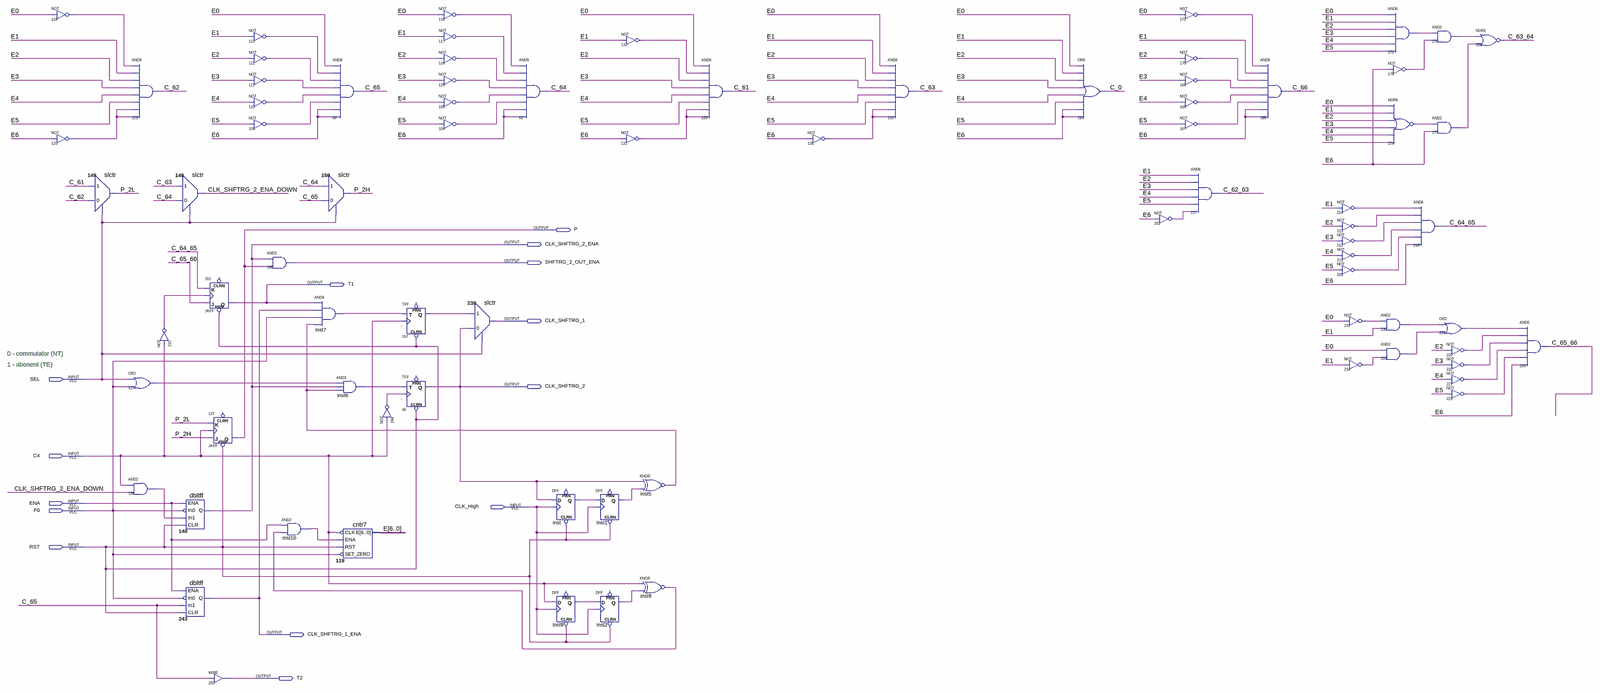
[diagram p0: schematic sheet, whole]
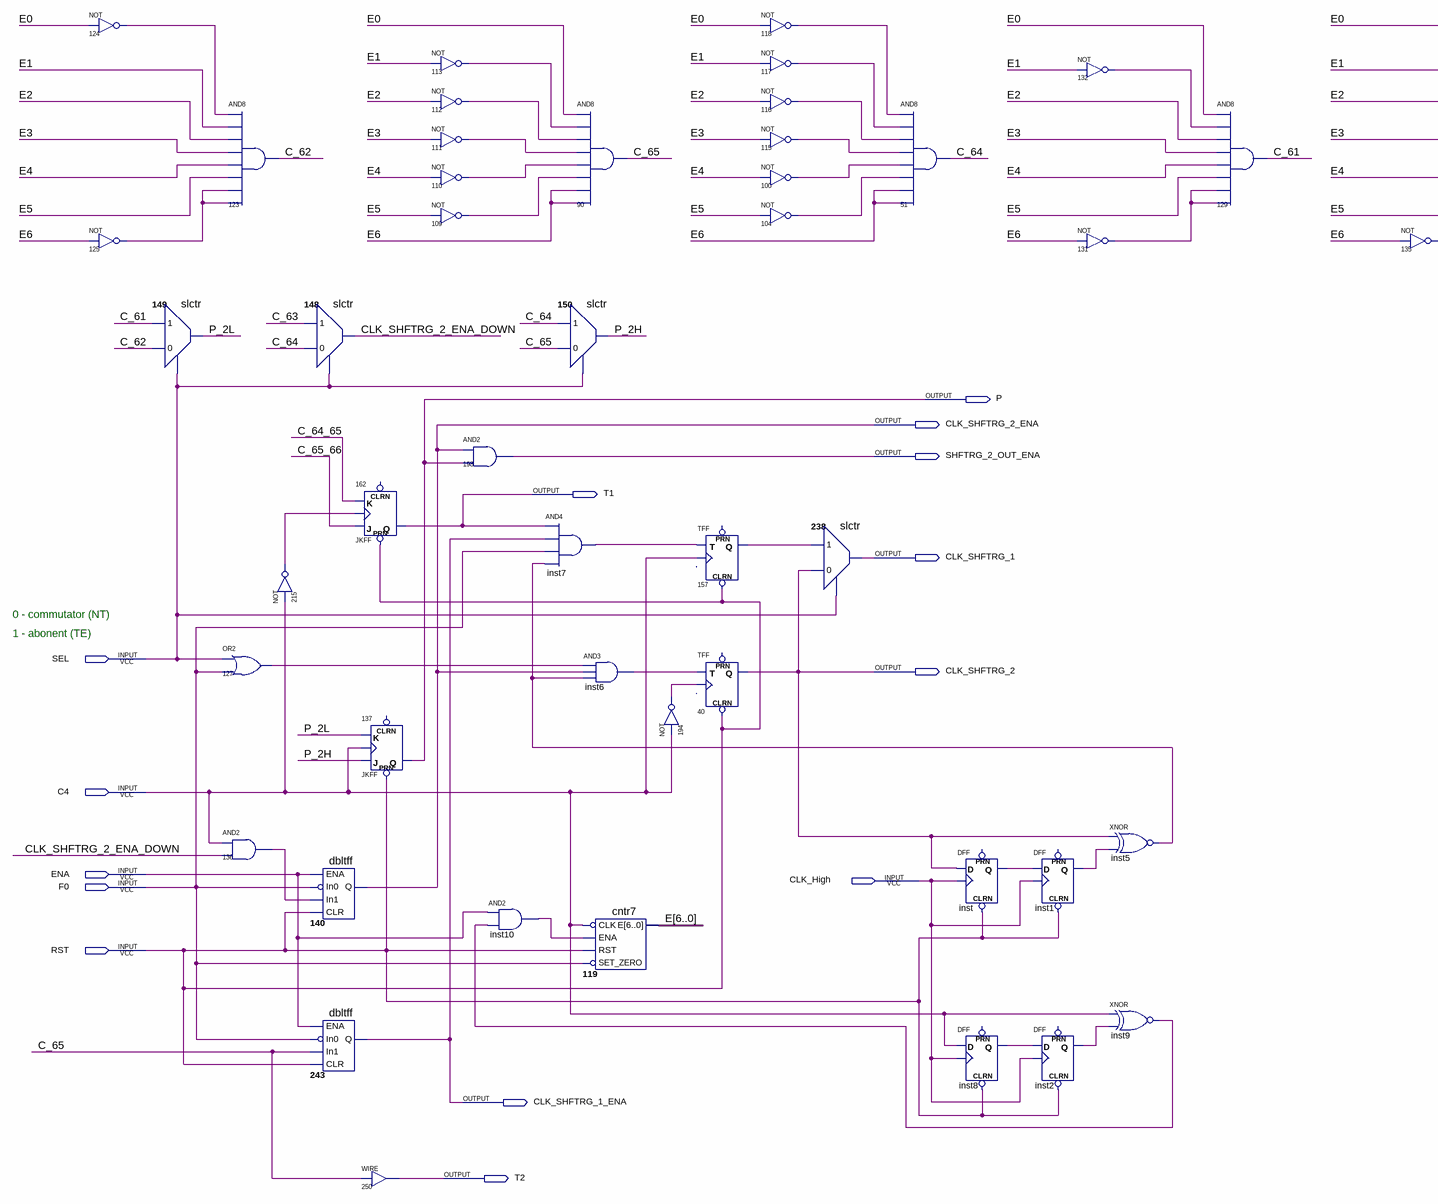
[diagram p1: schematic sheet, left part]
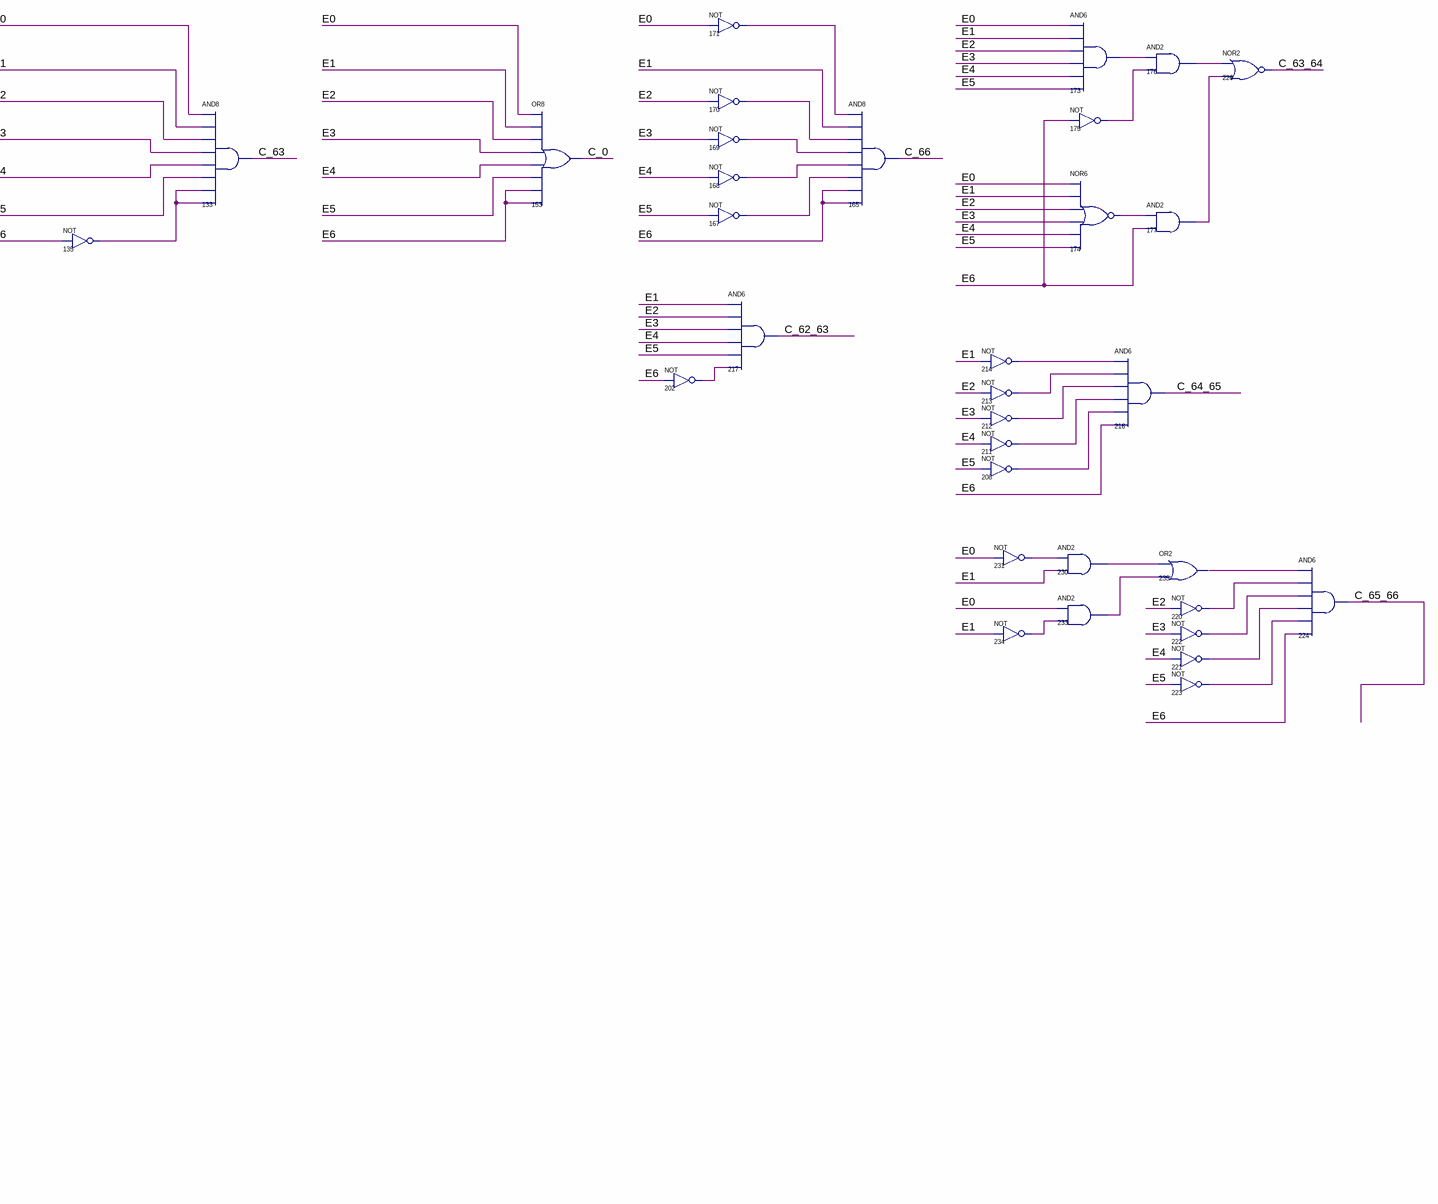
[diagram p2: schematic sheet, right part]
// Quartus schematic shrg_ctrl2.bdf as structural Verilog: 78 symbols, 14 pins
module shrg_ctrl2 (
  input  SEL,
  input  C4,
  input  ENA,
  input  CLK_High,
  input  F0,
  input  RST,
  output P,
  output CLK_SHFTRG_2_ENA,
  output SHFTRG_2_OUT_ENA,
  output T1,
  output CLK_SHFTRG_1,
  output CLK_SHFTRG_2,
  output CLK_SHFTRG_1_ENA,
  output T2
);

  wire C_0, C_61, C_62, C_62_63, C_63, C_63_64, C_64, C_64_65, C_65, C_65_66, C_66, CLK_SHFTRG_2_ENA_DOWN,
       inst1_q, inst2_q, inst5_out, inst6_out, inst7_out, inst8_q, inst9_out, inst10_out, inst_q, n100_out,
       n104_out, n109_out, n110_out, n111_out, n112_out, n113_out, n115_out, n116_out, n117_out, n118_out,
       n124_out, n125_out, n127_out, n131_out, n132_out, n135_out, n136_out, n157_q, n167_out, n168_out,
       n169_out, n170_out, n171_out, n173_out, n174_out, n175_out, n176_out, n177_out, n194_out, n202_out,
       n208_out, n211_out, n212_out, n213_out, n214_out, n215_out, n220_out, n221_out, n222_out, n223_out,
       n230_out, n231_out, n233_out, n234_out, n235_out, P_2H, P_2L;
  wire [6:0] E;

  not u_124 (n124_out, E[0]);
  not u_125 (n125_out, E[6]);
  slctr u_149 (.SEL(SEL), .In0(C_62), .In1(C_61), .Out(P_2L));
  and u_123 (C_62, n124_out, E[1], E[2], E[3], E[4], E[5], n125_out, n125_out);
  or u_127 (n127_out, SEL, F0);
  and u_136 (n136_out, C4, CLK_SHFTRG_2_ENA_DOWN);
  not u_215 (n215_out, C4);
  slctr u_148 (.SEL(SEL), .In0(C_64), .In1(C_63), .Out(CLK_SHFTRG_2_ENA_DOWN));
  dbltff u_140 (.ENA(ENA), .In0(~F0), .In1(n136_out), .CLR(RST), .Q(CLK_SHFTRG_2_ENA));
  dbltff u_243 (.ENA(ENA), .In0(~F0), .In1(C_65), .CLR(RST), .Q(CLK_SHFTRG_1_ENA));
  JKFF u_162 (.PRN(RST), .K(C_64_65), .J(C_65_66), .CLK(n215_out), .Q(T1));  // open: CLRN
  JKFF u_137 (.PRN(RST), .K(P_2L), .J(P_2H), .CLK(C4), .Q(P));  // open: CLRN
  assign T2 = C_65;  // WIRE 250
  not u_113 (n113_out, E[1]);
  not u_112 (n112_out, E[2]);
  not u_111 (n111_out, E[3]);
  not u_110 (n110_out, E[4]);
  not u_109 (n109_out, E[5]);
  and u_198 (SHFTRG_2_OUT_ENA, CLK_SHFTRG_2_ENA, P);
  and inst10 (inst10_out, ENA, inst9_out);
  and inst7 (inst7_out, T1, CLK_SHFTRG_1_ENA, F0, inst5_out);
  and u_90 (C_65, E[0], n113_out, n112_out, n111_out, n110_out, n109_out, E[6], E[6]);
  slctr u_150 (.SEL(SEL), .In0(C_65), .In1(C_64), .Out(P_2H));
  and inst6 (inst6_out, n127_out, CLK_SHFTRG_2_ENA, inst5_out);
  cntr7 u_119 (.CLK(~C4), .ENA(inst10_out), .RST(RST), .SET_ZERO(~F0), .E(E));
  TFF u_157 (.CLRN(RST), .T(inst7_out), .CLK(C4), .Q(n157_q));  // open: PRN
  TFF u_40 (.CLRN(RST), .T(inst6_out), .CLK(n194_out), .Q(CLK_SHFTRG_2));  // open: PRN
  not u_194 (n194_out, C4);
  not u_118 (n118_out, E[0]);
  not u_117 (n117_out, E[1]);
  not u_116 (n116_out, E[2]);
  not u_115 (n115_out, E[3]);
  not u_100 (n100_out, E[4]);
  not u_104 (n104_out, E[5]);
  slctr u_238 (.SEL(SEL), .In0(CLK_SHFTRG_2), .In1(n157_q), .Out(CLK_SHFTRG_1));
  and u_51 (C_64, n118_out, n117_out, n116_out, n115_out, n100_out, n104_out, E[6], E[6]);
  DFF inst (.CLRN(RST), .CLK(CLK_High), .D(CLK_SHFTRG_2), .Q(inst_q));  // open: PRN
  DFF inst8 (.CLRN(RST), .CLK(CLK_High), .D(C4), .Q(inst8_q));  // open: PRN
  DFF inst1 (.CLRN(RST), .CLK(CLK_High), .D(inst_q), .Q(inst1_q));  // open: PRN
  DFF inst2 (.CLRN(RST), .CLK(CLK_High), .D(inst8_q), .Q(inst2_q));  // open: PRN
  not u_132 (n132_out, E[1]);
  not u_131 (n131_out, E[6]);
  xnor inst5 (inst5_out, CLK_SHFTRG_2, inst1_q);
  xnor inst9 (inst9_out, C4, inst2_q);
  and u_129 (C_61, E[0], n132_out, E[2], E[3], E[4], E[5], n131_out, n131_out);
  not u_135 (n135_out, E[6]);
  and u_133 (C_63, E[0], E[1], E[2], E[3], E[4], E[5], n135_out, n135_out);
  or u_153 (C_0, E[0], E[1], E[2], E[3], E[4], E[5], E[6], E[6]);
  not u_202 (n202_out, E[6]);
  not u_171 (n171_out, E[0]);
  not u_170 (n170_out, E[2]);
  not u_169 (n169_out, E[3]);
  not u_168 (n168_out, E[4]);
  not u_167 (n167_out, E[5]);
  and u_217 (C_62_63, E[1], E[2], E[3], E[4], E[5], n202_out);
  and u_165 (C_66, n171_out, E[1], n170_out, n169_out, n168_out, n167_out, E[6], E[6]);
  not u_214 (n214_out, E[1]);
  not u_213 (n213_out, E[2]);
  not u_212 (n212_out, E[3]);
  not u_211 (n211_out, E[4]);
  not u_208 (n208_out, E[5]);
  not u_231 (n231_out, E[0]);
  not u_234 (n234_out, E[1]);
  and u_173 (n173_out, E[0], E[1], E[2], E[3], E[4], E[5]);
  not u_175 (n175_out, E[6]);
  nor u_174 (n174_out, E[0], E[1], E[2], E[3], E[4], E[5]);
  and u_230 (n230_out, n231_out, E[1]);
  and u_233 (n233_out, E[0], n234_out);
  and u_216 (C_64_65, n214_out, n213_out, n212_out, n211_out, n208_out, E[6]);
  and u_176 (n176_out, n173_out, n175_out);
  and u_177 (n177_out, n174_out, E[6]);
  or u_235 (n235_out, n230_out, n233_out);
  not u_220 (n220_out, E[2]);
  not u_222 (n222_out, E[3]);
  not u_221 (n221_out, E[4]);
  not u_223 (n223_out, E[5]);
  nor u_226 (C_63_64, n176_out, n177_out);
  and u_224 (C_65_66, n235_out, n220_out, n222_out, n221_out, n223_out, E[6]);

  // Notes on the sheet:
  //   0 - commutator (NT)
  //   1 - abonent (TE)
endmodule
